# EAGLE schematic Mezzanine_CoVASPSy_v1re2 (EAGLE 9.6.2)
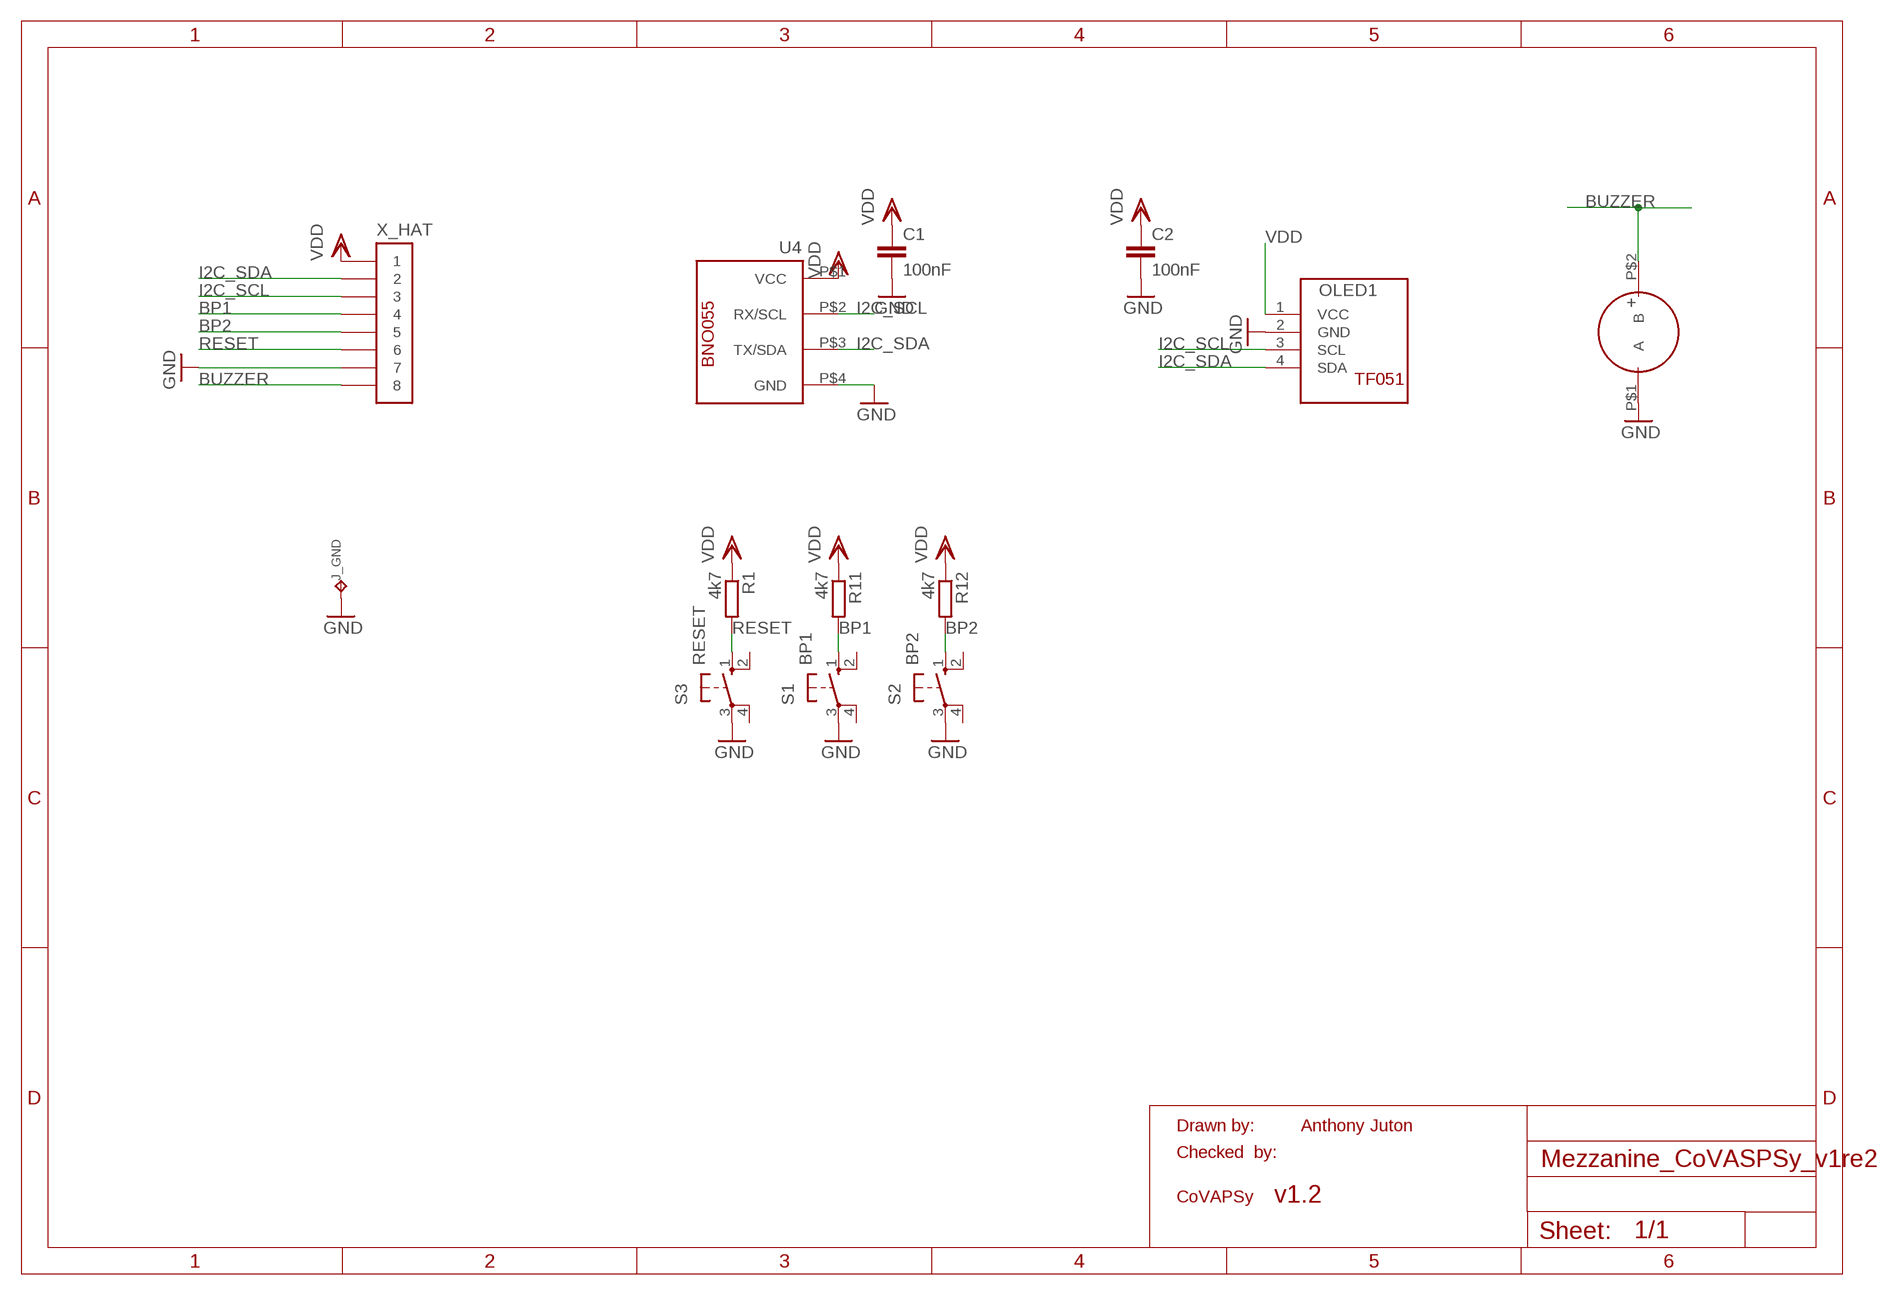
[diagram p0: schematic, sheet 1]

## Parts
BUZZER  BUZZER_SMA13_P75  [BUZZER_SMA_13_P75]
C1  100nF  C-EUC1206K  [C1206K]
C2  100nF  C-EUC1206K  [C1206K]
J_GND  COSSE_POIGN  [COSSE_POIGNARD]
OLED1  ECRAN_OLED_TF051  [ECRAN_OLED_TF051]
R1  4k7  R-EU_M1206  [M1206]
R11  4k7  R-EU_M1206  [M1206]
R12  4k7  R-EU_M1206  [M1206]
S1  BP1  10-XX  [B3F-10XX]
S2  BP2  10-XX  [B3F-10XX]
S3  RESET  10-XX  [B3F-10XX]
U4  MODULE_BNO055  [MODULE_BNO055]
X_HAT  MOLEX_8_COUDE  [MOLEX_8_COUDE]

## Nets
BP1: R11.2 S1.1(S) X_HAT.P$4
BP2: R12.2 S2.1(S) X_HAT.P$5
BUZZER: BUZZER.P$2(B) X_HAT.P$8
GND: BUZZER.P$1(A) C1.2 C2.2 J_GND.P$1 OLED1.2(GND) S1.3(P) S2.3(P) S3.3(P) U4.P$4(GND) X_HAT.P$7
I2C_SCL: OLED1.3(SCL) U4.P$2(RX/SCL) X_HAT.P$3
I2C_SDA: OLED1.4(SDA) U4.P$3(TX/SDA) X_HAT.P$2
RESET: R1.2 S3.1(S) X_HAT.P$6
VDD: C1.1 C2.1 OLED1.1(VCC) R1.1 R11.1 R12.1 U4.P$1(VCC) X_HAT.P$1
Unconnected: S1.2(S1) S1.4(P1) S2.2(S1) S2.4(P1) S3.2(S1) S3.4(P1)

## Notes on the sheet
- Drawn by: | Anthony Juton
- Checked  by:
- CoVAPSy | v1.2

## Library data of the parts
BUZZER = lib_ens_aj_v1:BUZZER_SMA13_P75
C1 C2 = rcl:C-EU: CAPACITOR, European symbol
J_GND = lib_ens_aj_v1:COSSE_POIGN
OLED1 = lib_ens_aj_v1:ECRAN_OLED_TF051
R1 R11 R12 = rcl:R-EU_: RESISTOR, European symbol
S1-S3 = switch-omron:10-XX: OMRON SWITCH; MPN: B3F-1000; OC_FARNELL: 176432; OC_NEWARK: 36M3542
U4 = lib_ens_aj_v1:MODULE_BNO055
X_HAT = lib_ens_aj_v1:MOLEX_8_COUDE

## Net classes
0 default: width 0.4 mm, drill 0.6 mm, clearance 0.3 mm